# Altium project CM4_TAB.PrjPcb
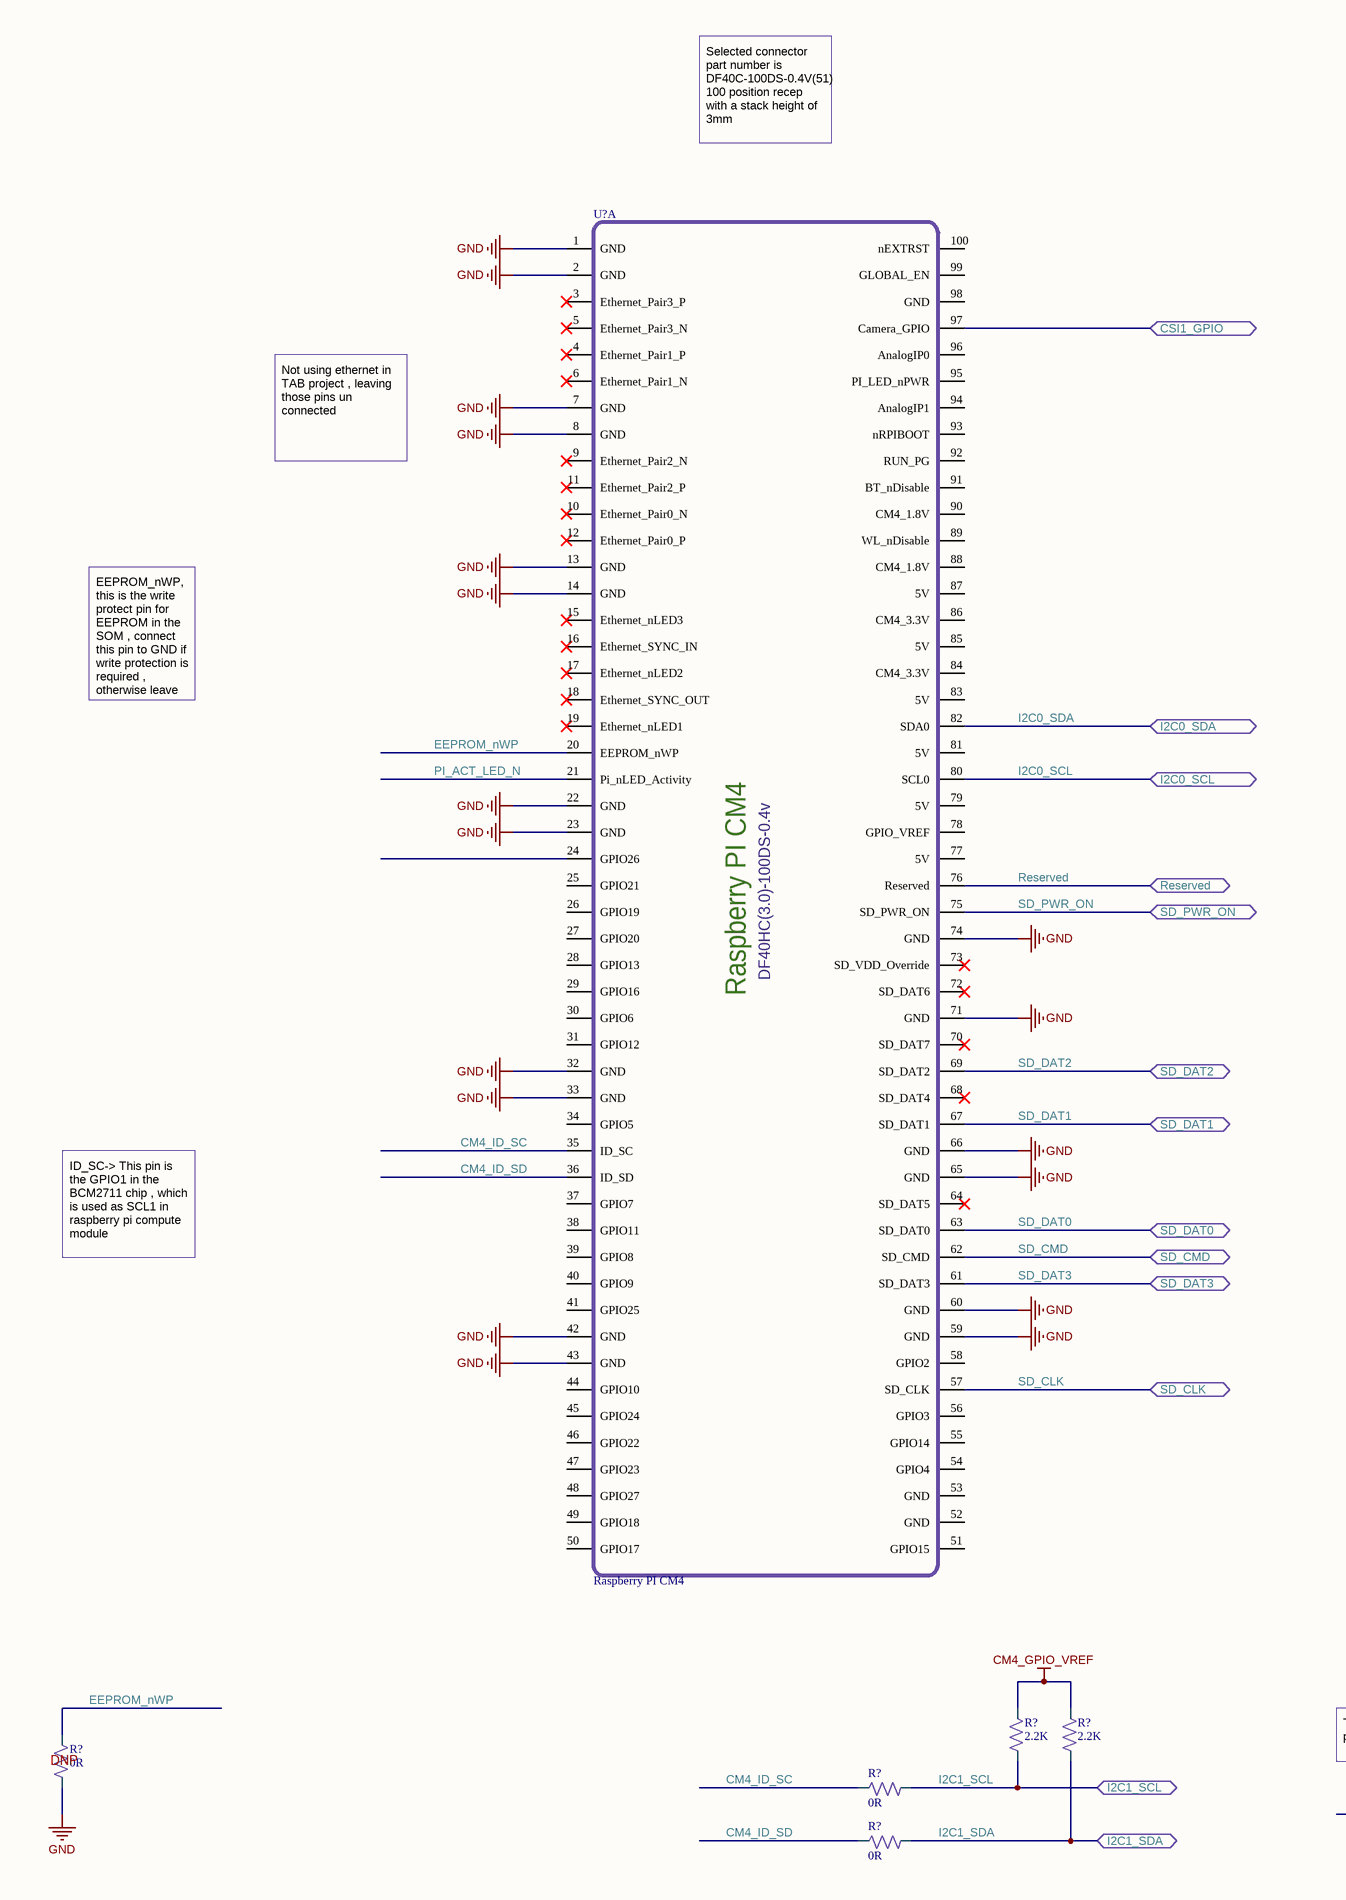
[diagram p0: Compute_module4_connector.SchDoc, left]
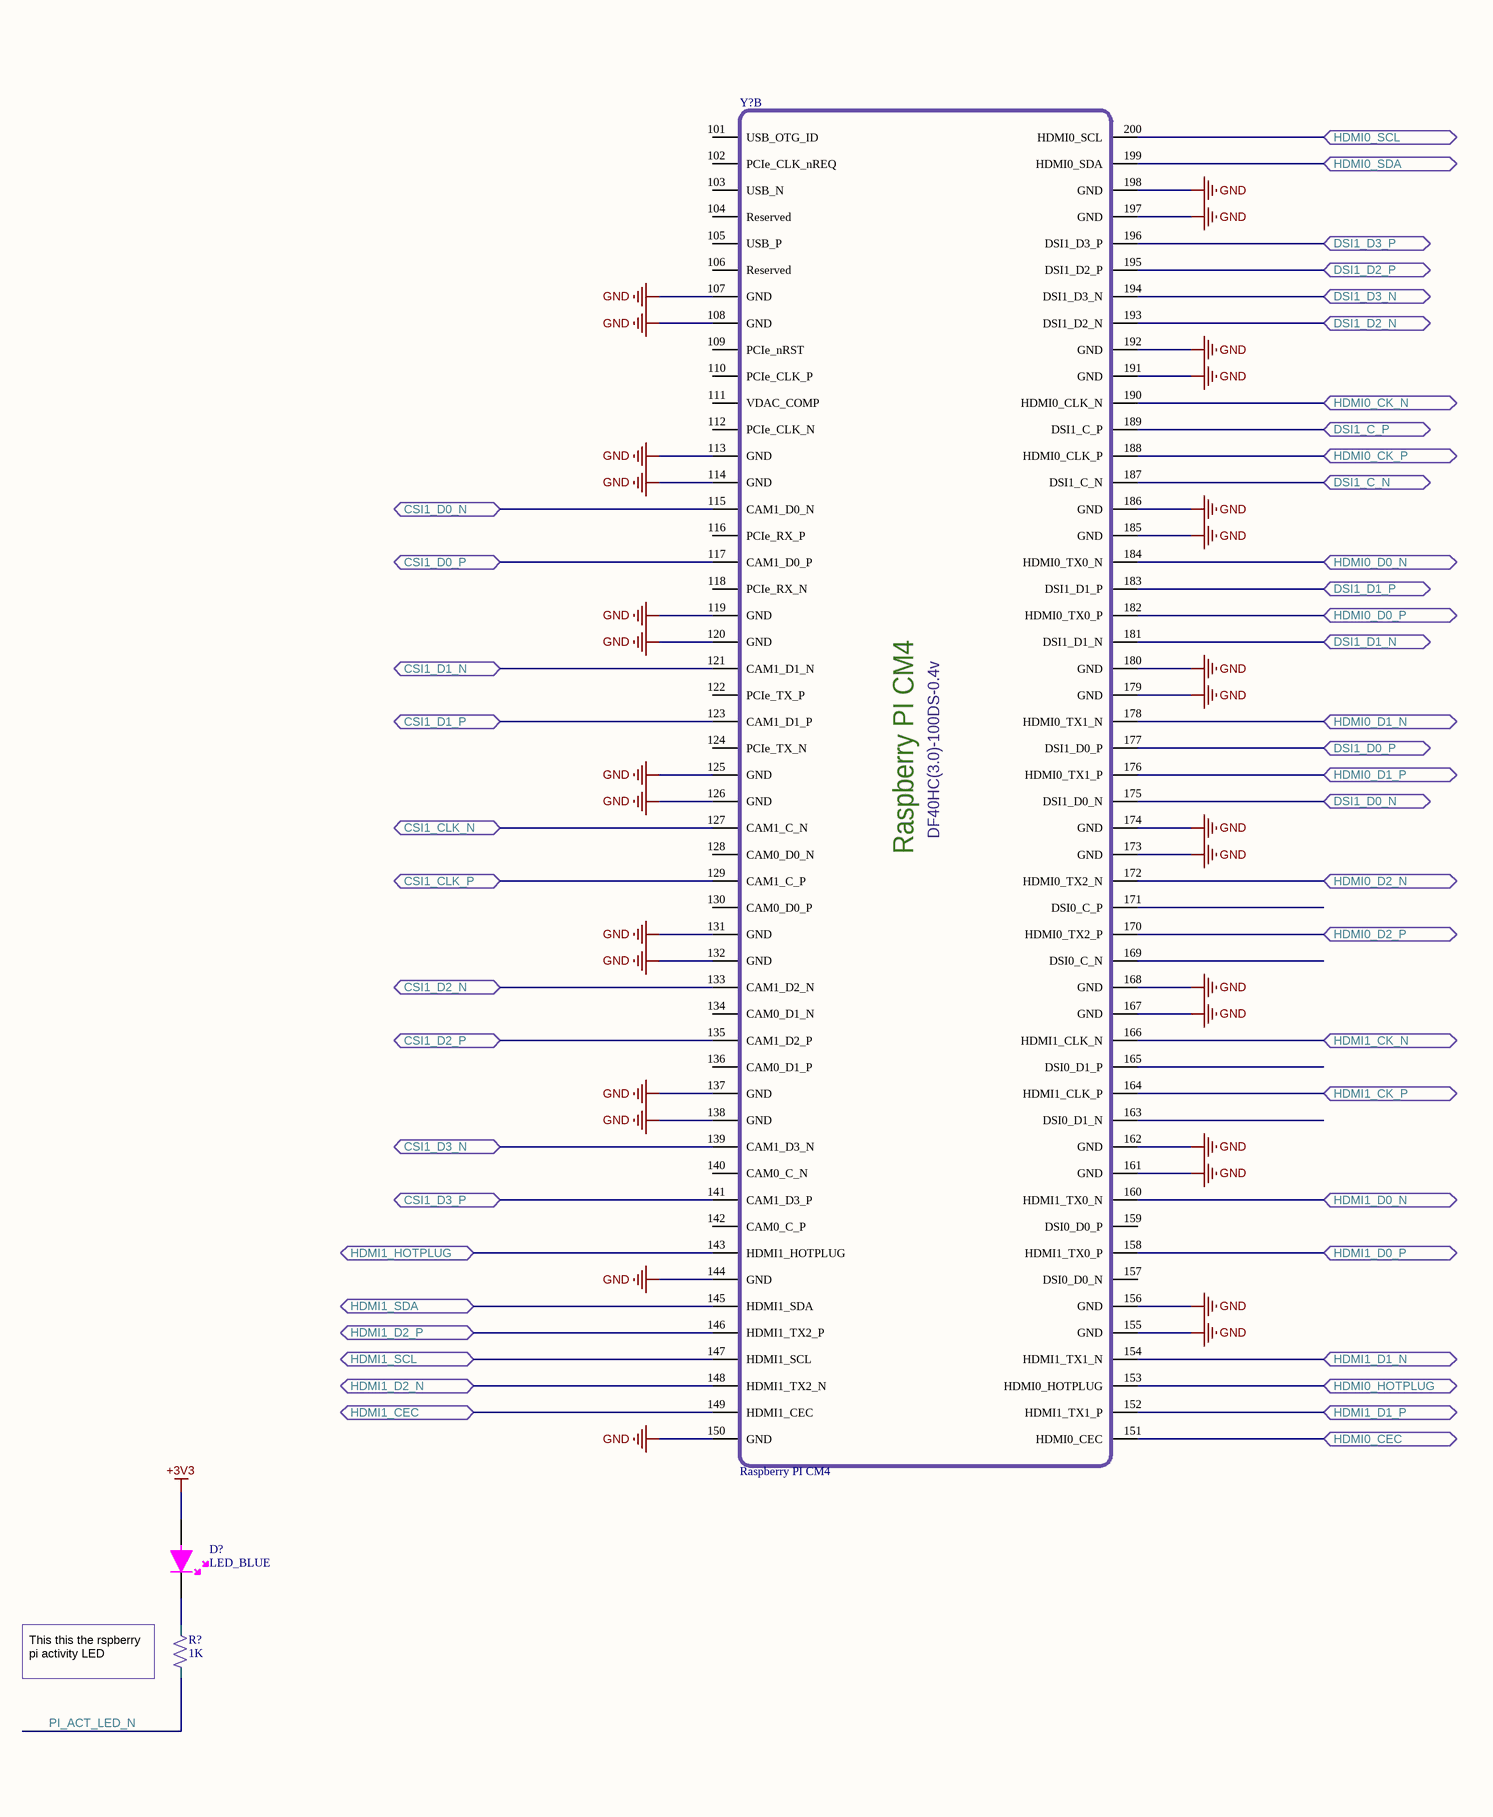
[diagram p1: Compute_module4_connector.SchDoc, right]
5 sheets, 21 parts. Net scope: flat (ports and power ports of the same name join across sheets).
Sheets:
  Compute_module4_connector.SchDoc
  dummy sheet.SchDoc
  SD_Card_Schematic.SchDoc
  HDMI_Schematic.SchDoc
  DSI_and_CSI_Connector.SchDoc

## Sheet Compute_module4_connector.SchDoc
size A2; SheetNumber: 1; SheetTotal: 5

### Parts
(Parts that share a designator on the sheet are numbered #1, #2 ... from top to bottom, then left to right.)
D?  LED_BLUE  [0603_LED]
R?#1  2.2K  [RESISTOR_0402]
R?#2  2.2K  [RESISTOR_0402]
R?#3  1K  [RESISTOR_0402]
R?#4  0R  [RESISTOR_0402]
R?#5  0R  [RESISTOR_0402]
R?#6  0R  [RESISTOR_0402]
U?#1  Raspberry PI CM4  [CM4-DF40HC(3.0)-100DS-0.4v_3mm_1.5mm]  (part A of 2)
Y?  Raspberry PI CM4  [CM4-DF40HC(3.0)-100DS-0.4v_3mm_1.5mm]  (part B of 2)

### Ports
CSI1_CLK_N (bidir), CSI1_CLK_P (bidir), CSI1_D0_N (bidir), CSI1_D0_P (bidir), CSI1_D1_N (bidir), CSI1_D1_P (bidir), CSI1_D2_N (bidir), CSI1_D2_P (bidir), CSI1_D3_N (bidir), CSI1_D3_P (bidir), CSI1_GPIO (bidir), DSI1_C_N (bidir), DSI1_C_P (bidir), DSI1_D0_N (bidir), DSI1_D0_P (bidir), DSI1_D1_N (bidir), DSI1_D1_P (bidir), DSI1_D2_N (bidir), DSI1_D2_P (bidir), DSI1_D3_N (bidir), DSI1_D3_P (bidir), HDMI0_CEC (bidir), HDMI0_CK_N (bidir), HDMI0_CK_P (bidir), HDMI0_D0_N (bidir), HDMI0_D0_P (bidir), HDMI0_D1_N (bidir), HDMI0_D1_P (bidir), HDMI0_D2_N (bidir), HDMI0_D2_P (bidir), HDMI0_HOTPLUG (bidir), HDMI0_SCL (bidir), HDMI0_SDA (bidir), HDMI1_CEC (bidir), HDMI1_CK_N (bidir), HDMI1_CK_P (bidir), HDMI1_D0_N (bidir), HDMI1_D0_P (bidir), HDMI1_D1_N (bidir), HDMI1_D1_P (bidir), HDMI1_D2_N (bidir), HDMI1_D2_P (bidir), HDMI1_HOTPLUG (bidir), HDMI1_SCL (bidir), HDMI1_SDA (bidir), I2C0_SCL (bidir), I2C0_SDA (bidir), I2C1_SCL (bidir), I2C1_SDA (bidir), Reserved (bidir), SD_CLK (bidir), SD_CMD (bidir), SD_DAT0 (bidir), SD_DAT1 (bidir), SD_DAT2 (bidir), SD_DAT3 (bidir), SD_PWR_ON (bidir)

### Nets
+3V3: D?.1
CM4_GPIO_VREF: R?#1.2 R?#2.2
GND: R?#4.1 U?#1.1(GND) U?#1.2(GND) U?#1.7(GND) U?#1.8(GND) U?#1.13(GND) U?#1.14(GND) U?#1.22(GND) U?#1.23(GND) U?#1.32(GND) U?#1.33(GND) U?#1.42(GND) U?#1.43(GND) U?#1.59(GND) U?#1.60(GND) U?#1.65(GND) U?#1.66(GND) U?#1.71(GND) U?#1.74(GND) Y?.107(GND) Y?.108(GND) Y?.113(GND) Y?.114(GND) Y?.119(GND) Y?.120(GND) Y?.125(GND) Y?.126(GND) Y?.131(GND) Y?.132(GND) Y?.137(GND) Y?.138(GND) Y?.144(GND) Y?.150(GND) Y?.155(GND) Y?.156(GND) Y?.161(GND) Y?.162(GND) Y?.167(GND) Y?.168(GND) Y?.173(GND) Y?.174(GND) Y?.179(GND) Y?.180(GND) Y?.185(GND) Y?.186(GND) Y?.191(GND) Y?.192(GND) Y?.197(GND) Y?.198(GND)
CM4_ID_SC: R?#5.2 U?#1.35(ID_SC)
CM4_ID_SD: R?#6.2 U?#1.36(ID_SD)
CSI1_CLK_N: Y?.127(CAM1_C_N) ; port CSI1_CLK_N
CSI1_CLK_P: Y?.129(CAM1_C_P) ; port CSI1_CLK_P
CSI1_D0_N: Y?.115(CAM1_D0_N) ; port CSI1_D0_N
CSI1_D0_P: Y?.117(CAM1_D0_P) ; port CSI1_D0_P
CSI1_D1_N: Y?.121(CAM1_D1_N) ; port CSI1_D1_N
CSI1_D1_P: Y?.123(CAM1_D1_P) ; port CSI1_D1_P
CSI1_D2_N: Y?.133(CAM1_D2_N) ; port CSI1_D2_N
CSI1_D2_P: Y?.135(CAM1_D2_P) ; port CSI1_D2_P
CSI1_D3_N: Y?.139(CAM1_D3_N) ; port CSI1_D3_N
CSI1_D3_P: Y?.141(CAM1_D3_P) ; port CSI1_D3_P
CSI1_GPIO: U?#1.97(Camera_GPIO) ; port CSI1_GPIO
DSI1_C_N: Y?.187(DSI1_C_N) ; port DSI1_C_N
DSI1_C_P: Y?.189(DSI1_C_P) ; port DSI1_C_P
DSI1_D0_N: Y?.175(DSI1_D0_N) ; port DSI1_D0_N
DSI1_D0_P: Y?.177(DSI1_D0_P) ; port DSI1_D0_P
DSI1_D1_N: Y?.181(DSI1_D1_N) ; port DSI1_D1_N
DSI1_D1_P: Y?.183(DSI1_D1_P) ; port DSI1_D1_P
DSI1_D2_N: Y?.193(DSI1_D2_N) ; port DSI1_D2_N
DSI1_D2_P: Y?.195(DSI1_D2_P) ; port DSI1_D2_P
DSI1_D3_N: Y?.194(DSI1_D3_N) ; port DSI1_D3_N
DSI1_D3_P: Y?.196(DSI1_D3_P) ; port DSI1_D3_P
EEPROM_nWP: R?#4.2 U?#1.20(EEPROM_nWP)
HDMI0_CEC: Y?.151(HDMI0_CEC) ; port HDMI0_CEC
HDMI0_CK_N: Y?.190(HDMI0_CLK_N) ; port HDMI0_CK_N
HDMI0_CK_P: Y?.188(HDMI0_CLK_P) ; port HDMI0_CK_P
HDMI0_D0_N: Y?.184(HDMI0_TX0_N) ; port HDMI0_D0_N
HDMI0_D0_P: Y?.182(HDMI0_TX0_P) ; port HDMI0_D0_P
HDMI0_D1_N: Y?.178(HDMI0_TX1_N) ; port HDMI0_D1_N
HDMI0_D1_P: Y?.176(HDMI0_TX1_P) ; port HDMI0_D1_P
HDMI0_D2_N: Y?.172(HDMI0_TX2_N) ; port HDMI0_D2_N
HDMI0_D2_P: Y?.170(HDMI0_TX2_P) ; port HDMI0_D2_P
HDMI0_HOTPLUG: Y?.153(HDMI0_HOTPLUG) ; port HDMI0_HOTPLUG
HDMI0_SCL: Y?.200(HDMI0_SCL) ; port HDMI0_SCL
HDMI0_SDA: Y?.199(HDMI0_SDA) ; port HDMI0_SDA
HDMI1_CEC: Y?.149(HDMI1_CEC) ; port HDMI1_CEC
HDMI1_CK_N: Y?.166(HDMI1_CLK_N) ; port HDMI1_CK_N
HDMI1_CK_P: Y?.164(HDMI1_CLK_P) ; port HDMI1_CK_P
HDMI1_D0_N: Y?.160(HDMI1_TX0_N) ; port HDMI1_D0_N
HDMI1_D0_P: Y?.158(HDMI1_TX0_P) ; port HDMI1_D0_P
HDMI1_D1_N: Y?.154(HDMI1_TX1_N) ; port HDMI1_D1_N
HDMI1_D1_P: Y?.152(HDMI1_TX1_P) ; port HDMI1_D1_P
HDMI1_D2_N: Y?.148(HDMI1_TX2_N) ; port HDMI1_D2_N
HDMI1_D2_P: Y?.146(HDMI1_TX2_P) ; port HDMI1_D2_P
HDMI1_HOTPLUG: Y?.143(HDMI1_HOTPLUG) ; port HDMI1_HOTPLUG
HDMI1_SCL: Y?.147(HDMI1_SCL) ; port HDMI1_SCL
HDMI1_SDA: Y?.145(HDMI1_SDA) ; port HDMI1_SDA
I2C0_SCL: U?#1.80(SCL0) ; port I2C0_SCL
I2C0_SDA: U?#1.82(SDA0) ; port I2C0_SDA
I2C1_SCL: R?#1.1 R?#5.1 ; port I2C1_SCL
I2C1_SDA: R?#2.1 R?#6.1 ; port I2C1_SDA
PI_ACT_LED_N: R?#3.1 U?#1.21(Pi_nLED_Activity)
Reserved: U?#1.76(Reserved) ; port Reserved
SD_CLK: U?#1.57(SD_CLK) ; port SD_CLK
SD_CMD: U?#1.62(SD_CMD) ; port SD_CMD
SD_DAT0: U?#1.63(SD_DAT0) ; port SD_DAT0
SD_DAT1: U?#1.67(SD_DAT1) ; port SD_DAT1
SD_DAT2: U?#1.69(SD_DAT2) ; port SD_DAT2
SD_DAT3: U?#1.61(SD_DAT3) ; port SD_DAT3
SD_PWR_ON: U?#1.75(SD_PWR_ON) ; port SD_PWR_ON
NetD?_2: D?.2 R?#3.2

Not connected (* = marked no-connect by the designer): U?#1 3(Ethernet_Pair3_P)* 4(Ethernet_Pair1_P)* 5(Ethernet_Pair3_N)* 6(Ethernet_Pair1_N)* 9(Ethernet_Pair2_N)* 10(Ethernet_Pair0_N)* 11(Ethernet_Pair2_P)* 12(Ethernet_Pair0_P)* 15(Ethernet_nLED3)* 16(Ethernet_SYNC_IN)* 17(Ethernet_nLED2)* 18(Ethernet_SYNC_OUT)* 19(Ethernet_nLED1)* 24(GPIO26) 25(GPIO21) 26(GPIO19) 27(GPIO20) 28(GPIO13) 29(GPIO16) 30(GPIO6) 31(GPIO12) 34(GPIO5) 37(GPIO7) 38(GPIO11) 39(GPIO8) 40(GPIO9) 41(GPIO25) 44(GPIO10) 45(GPIO24) 46(GPIO22) 47(GPIO23) 48(GPIO27) 49(GPIO18) 50(GPIO17) 51(GPIO15) 52(GND) 53(GND) 54(GPIO4) 55(GPIO14) 56(GPIO3) 58(GPIO2) 64(SD_DAT5)* 68(SD_DAT4)* 70(SD_DAT7)* 72(SD_DAT6)* 73(SD_VDD_Override)* 77(5V) 78(GPIO_VREF) 79(5V) 81(5V) 83(5V) 84(CM4_3.3V) 85(5V) 86(CM4_3.3V) 87(5V) 88(CM4_1.8V) 89(WL_nDisable) 90(CM4_1.8V) 91(BT_nDisable) 92(RUN_PG) 93(nRPIBOOT) 94(AnalogIP1) 95(PI_LED_nPWR) 96(AnalogIP0) 98(GND) 99(GLOBAL_EN) 100(nEXTRST); Y? 101(USB_OTG_ID) 102(PCIe_CLK_nREQ) 103(USB_N) 104(Reserved) 105(USB_P) 106(Reserved) 109(PCIe_nRST) 110(PCIe_CLK_P) 111(VDAC_COMP) 112(PCIe_CLK_N) 116(PCIe_RX_P) 118(PCIe_RX_N) 122(PCIe_TX_P) 124(PCIe_TX_N) 128(CAM0_D0_N) 130(CAM0_D0_P) 134(CAM0_D1_N) 136(CAM0_D1_P) 140(CAM0_C_N) 142(CAM0_C_P) 157(DSI0_D0_N) 159(DSI0_D0_P) 163(DSI0_D1_N) 165(DSI0_D1_P) 169(DSI0_C_N) 171(DSI0_C_P)

### Notes on the sheet
- Selected connector part number is DF40C-100DS-0.4V(51)
  100 position recep with a stack height of 3mm
- Not using ethernet in TAB project , leaving those pins un connected
- EEPROM_nWP, this is the write protect pin for EEPROM in the SOM , connect this pin to GND if write protection is required , otherwise leave this pin unconnected , an  internal pull up is provided for this via 100K resistor to 3v3
- ID_SC-> This pin is the GPIO1 in the BCM2711 chip , which is used as SCL1 in raspberry pi compute module
  ID_SC -> This pin is the GPIO0 pin in the BCM2711 chip , which is used as SDA1 in raspberry pi compute module
- (near R?#4) DNP
- (near R?#3) This this the rspberry pi activity LED
- (in symbol cm4, part A) DF40HC(3.0)-100DS-0.4v
- (in symbol cm4, part B) DF40HC(3.0)-100DS-0.4v

### Library data of the parts
D? = NCD0603B1: blue 0603 Light Emitting Diodes (LED) ROHS; Manufacturer: Foshan; ManufacturerPartNumber: NCD0603B1; SupplierPartNumber: C84266; Supplier: LCSC; MinTemp: *; MaxTemp: *; Price: 0.0171; ComponentLink1Description: SupplierURL; ComponentLink1URL: https://www.lcsc.com/product-detail/Light-Emitting-Diodes-LED_Foshan-NationStar-Optoelectronics-NCD0603B1_C84266.html
R?#1 R?#2 = ERJPA2F2201X: 200mW Thick Film Resistors ±1% 2.2kΩ 0402 Chip Resistor - Surface Mount ROHS; Manufacturer: Panasonic; MinTemp: -55℃; MaxTemp: +155℃; ManufacturerPartNumber: ERJPA2F2201X; SupplierPartNumber: C427242; Supplier: LCSC; Price: 0.0307; ComponentLink1Description: SupplierURL; ComponentLink1URL: https://www.lcsc.com/product-detail/Chip-Resistor-Surface-Mount_PANASONIC-ERJPA2F2201X_C427242.html
R?#3 = ERJ2RKF1001X: ±1% 100mW ±100ppm/℃ -55℃~+155℃ 1kΩ 0402 Chip Resistor - Surface Mount ROHS; Manufacturer: PANASONIC; MinTemp: -55℃; MaxTemp: +155℃; ManufacturerPartNumber: ERJ2RKF1001X; SupplierPartNumber: C242161; Supplier: LCSC; ComponentLink1Description: SupplierURL; ComponentLink1URL: https://lcsc.com/product-detail/Chip-Resistor-Surface-Mount_PANASONIC-ERJ2RKF1001X_C242161.html
R?#4 = HCJ0402ZT0R00_1: 125mW Thick Film Resistors -55℃~+155℃ 0Ω 0402 Chip Resistor - Surface Mount ROHS; Manufacturer: SEI(Stackpole Elec); MinTemp: -55℃; MaxTemp: +155℃; ManufacturerPartNumber: HCJ0402ZT0R00; SupplierPartNumber: C346504; Supplier: LCSC; Price: 0.1734; ComponentLink1Description: SupplierURL; ComponentLink1URL: https://lcsc.com/product-detail/Chip-Resistor-Surface-Mount_SEI-Stackpole-Elec-HCJ0402ZT0R00_C346504.html
R?#5 R?#6 = HCJ0402ZT0R00: 0 Ohms Jumper 0.125W, 1/8W Chip Resistor 0402 (1005 Metric) Automotive AEC-Q200 Metal Foil; Manufacturer: Stackpole Electronics Inc; MinTemp: -55°C; MaxTemp: 155°C; ManufacturerPartNumber: HCJ0402ZT0R00; SupplierPartNumber: HCJ0402ZT0R00CT-ND; Supplier: Digikey; PartStatus: Active; Price: 38.65(INR); ComponentLink1Description: SupplierURL; ComponentLink1URL: https://www.digikey.in/en/products/detail/stackpole-electronics-inc/HCJ0402ZT0R00/4357659
U?#1 Y? = cm4: Raspberry pi compute module 4

## Sheet dummy sheet.SchDoc
size A0; SheetNumber: 2; SheetTotal: 5

## Sheet SD_Card_Schematic.SchDoc
size A3; SheetNumber: 3; SheetTotal: 3
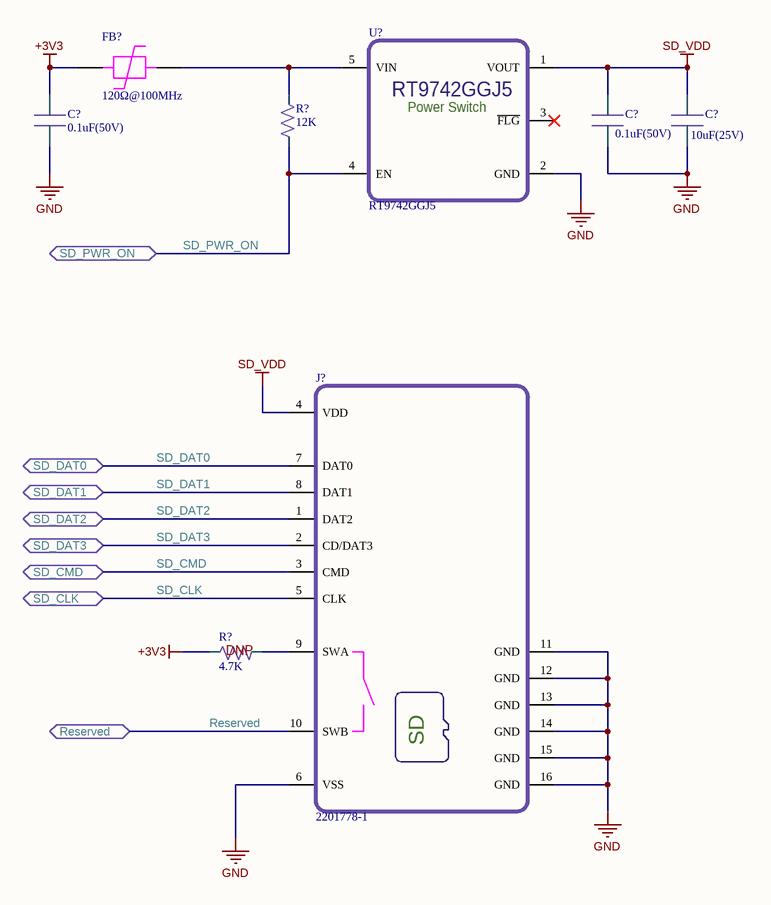
[diagram p2: SD_Card_Schematic.SchDoc]

### Parts
(Parts that share a designator on the sheet are numbered #1, #2 ... from top to bottom, then left to right.)
C?#1  0.1uF(50V)  [Capacitor_0603]
C?#2  0.1uF(50V)  [Capacitor_0603]
C?#3  10uF(25V)  [Capacitor_0603]
FB?  120Ω@100MHz  [FB0402]
J?#1  2201778-1
R?#7  12K  [RESISTOR_0402]
R?#8  4.7K  [RESISTOR_0402]
U?#2  RT9742GGJ5  [SOT23-5]

### Ports
Reserved (bidir), SD_CLK (bidir), SD_CMD (bidir), SD_DAT0 (bidir), SD_DAT1 (bidir), SD_DAT2 (bidir), SD_DAT3 (bidir), SD_PWR_ON (bidir)

### Nets
+3V3: C?#1.2 FB?.1 R?#8.2
GND: C?#1.1 C?#2.1 C?#3.1 J?#1.6(VSS) J?#1.11(GND) J?#1.12(GND) J?#1.13(GND) J?#1.14(GND) J?#1.15(GND) J?#1.16(GND) U?#2.2(GND)
SD_VDD: C?#2.2 C?#3.2 J?#1.4(VDD) U?#2.1(VOUT)
Reserved: J?#1.10(SWB) ; port Reserved
SD_CLK: J?#1.5(CLK) ; port SD_CLK
SD_CMD: J?#1.3(CMD) ; port SD_CMD
SD_DAT0: J?#1.7(DAT0) ; port SD_DAT0
SD_DAT1: J?#1.8(DAT1) ; port SD_DAT1
SD_DAT2: J?#1.1(DAT2) ; port SD_DAT2
SD_DAT3: J?#1.2(CD/DAT3) ; port SD_DAT3
SD_PWR_ON: R?#7.1 U?#2.4(EN) ; port SD_PWR_ON
NetFB?_2: FB?.2 R?#7.2 U?#2.5(VIN)
NetJ?#1_9: J?#1.9(SWA) R?#8.1

Not connected (* = marked no-connect by the designer): U?#2 3(~{FLG})*

### Notes on the sheet
- (near R?#8) DNP
- (in symbol 2201778-1) SD
- (in symbol RT9742GGJ5) Power Switch

### Library data of the parts
C?#1 C?#2 = GCJ188R71H104KA12D: 50V 100nF X7R ±10% 0603 Multilayer Ceramic Capacitors MLCC - SMD/SMT ROHS; Manufacturer: Murata; MinTemp: -55°C; MaxTemp: 125 °C; ManufacturerPartNumber: GCJ188R71H104KA12D; SupplierPartNumber: C161115; Supplier: LCSC; Price: 0.83; ComponentLink1Description: SupplierURL; ComponentLink1URL: https://www.lcsc.com/product-detail/Multilayer-Ceramic-Capacitors-MLCC-SMD-SMT_Murata-Electronics-GCJ188R71H104KA12D_C161115.html
C?#3 = C0603X5R106K250NT: 25V 10uF ±10% 0603 Multilayer Ceramic Capacitors MLCC - SMD/SMT ROHS; Manufacturer: sanyear; MinTemp: -55 C; MaxTemp: 125 C; ManufacturerPartNumber: C0603X5R106K250NT; SupplierPartNumber: C729457; Supplier: LCSC; Price: 0.0390; ComponentLink1Description: SupplierURL; ComponentLink1URL: https://www.lcsc.com/product-detail/Multilayer-Ceramic-Capacitors-MLCC-SMD-SMT_SANYEAR-C0603X5R106K250NT_C729457.html
FB? = BLM15KD121SN1D: 1.5A 1 70mΩ 120Ω@100MHz ±25% 0402 Ferrite Beads ROHS; Manufacturer: Murata Electronics; MinTemp: -55°C; MaxTemp: +125°C; ManufacturerPartNumber: BLM15KD121SN1D; SupplierPartNumber: C710343; Supplier: LCSC; Price: 0.0169; ComponentLink1Description: SupplierURL; ComponentLink1URL: https://lcsc.com/product-detail/Ferrite-Beads_Murata-Electronics-BLM15KD121SN1D_C710343.html
J?#1 = 2201778-1: - SD Card Connectors ROHS; Manufacturer: TE Connectivity; ManufacturerPartNumber: 2201778-1; SupplierPartNumber: C590836; Supplier: LCSC; MinTemp: *; MaxTemp: *; Price: 2.2941; ComponentLink1Description: SupplierURL; ComponentLink1URL: https://www.lcsc.com/product-detail/span-style-background-color-ff0-SD-span-span-style-background-color-ff0-Card-span-Connectors_TE-Connectivity-2201778-1_C590836.html
R?#7 = HPCR0402F12K0K9: ±1% 100mW Thick Film Resistors 50V ±100ppm/℃ 12kΩ -55℃~+125℃ 0402 Chip Resistor - Surface Mount ROHS; Manufacturer: Resistor.Today; MinTemp: -55℃; MaxTemp: +125℃; ManufacturerPartNumber: HPCR0402F12K0K9; SupplierPartNumber: C363271; Supplier: LCSC; Price: 0.0074; ComponentLink1Description: SupplierURL; ComponentLink1URL: https://lcsc.com/product-detail/Chip-Resistor-Surface-Mount_Resistor-Today-HPCR0402F12K0K9_C363271.html
R?#8 = ERJPA2F4701X: ±1% 200mW ±100ppm/℃ -55℃~+155℃ 4.7kΩ 0402 Chip Resistor - Surface Mount ROHS; Manufacturer: PANASONIC; MinTemp: -55℃; MaxTemp: +155℃; ManufacturerPartNumber: ERJPA2F4701X; SupplierPartNumber: C427244; Supplier: LCSC; Price: 0.0477; ComponentLink1Description: SupplierURL; ComponentLink1URL: https://lcsc.com/product-detail/Chip-Resistor-Surface-Mount_PANASONIC-ERJPA2F4701X_C427244.html
U?#2 = RT9742GGJ5: TSOT-23-5 Power Distribution Switches ROHS; Manufacturer: Richtek; ManufacturerPartNumber: RT9742GGJ5; SupplierPartNumber: C250547; Supplier: LCSC; MinTemp: *; MaxTemp: *; Price: 1.3062; ComponentLink1Description: SupplierURL; ComponentLink1URL: https://www.lcsc.com/product-detail/Power-Distribution-Switches_Richtek-Tech-RT9742GGJ5_C250547.html

## Sheet HDMI_Schematic.SchDoc
size A2; SheetNumber: 4; SheetTotal: 5
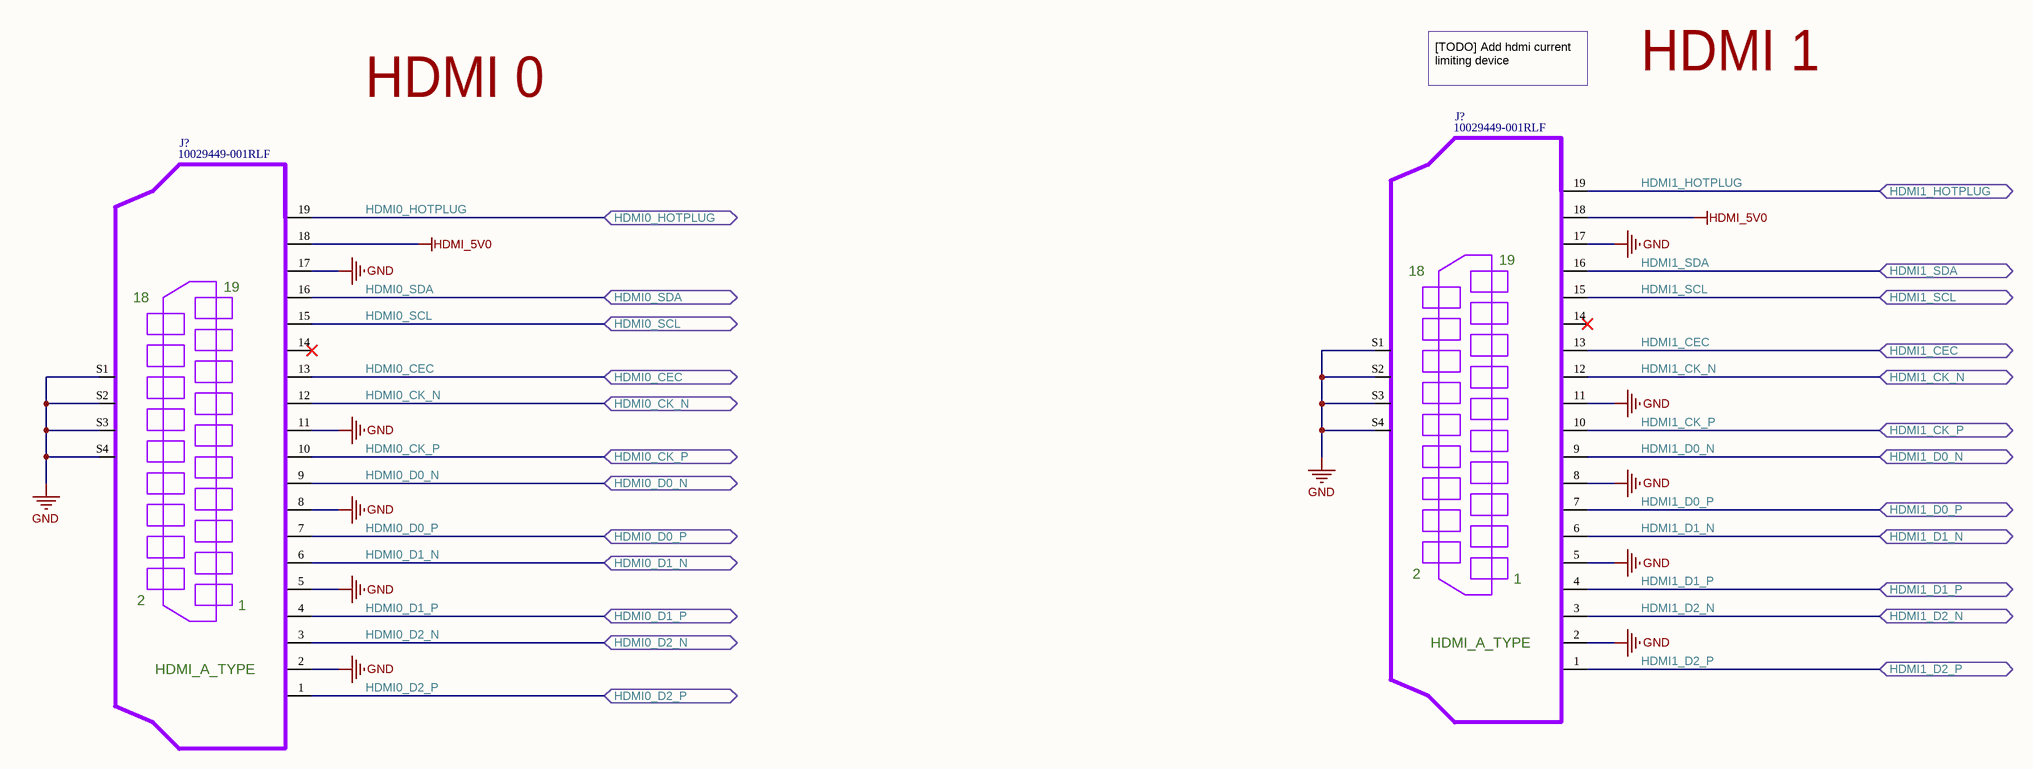
[diagram p3: HDMI_Schematic.SchDoc]

### Parts
(Parts that share a designator on the sheet are numbered #1, #2 ... from top to bottom, then left to right.)
J?#2  10029449-001RLF  [AMPHENOL_10029449-001RLF_HDMI]
J?#3  10029449-001RLF  [AMPHENOL_10029449-001RLF_HDMI]

### Ports
HDMI0_CEC (bidir), HDMI0_CK_N (bidir), HDMI0_CK_P (bidir), HDMI0_D0_N (bidir), HDMI0_D0_P (bidir), HDMI0_D1_N (bidir), HDMI0_D1_P (bidir), HDMI0_D2_N (bidir), HDMI0_D2_P (bidir), HDMI0_HOTPLUG (bidir), HDMI0_SCL (bidir), HDMI0_SDA (bidir), HDMI1_CEC (bidir), HDMI1_CK_N (bidir), HDMI1_CK_P (bidir), HDMI1_D0_N (bidir), HDMI1_D0_P (bidir), HDMI1_D1_N (bidir), HDMI1_D1_P (bidir), HDMI1_D2_N (bidir), HDMI1_D2_P (bidir), HDMI1_HOTPLUG (bidir), HDMI1_SCL (bidir), HDMI1_SDA (bidir)

### Nets
GND: J?#2.2 J?#2.5 J?#2.8 J?#2.11 J?#2.17 J?#2.S1 J?#2.S2 J?#2.S3 J?#2.S4 J?#3.2 J?#3.5 J?#3.8 J?#3.11 J?#3.17 J?#3.S1 J?#3.S2 J?#3.S3 J?#3.S4
HDMI_5V0: J?#2.18 J?#3.18
HDMI0_CEC: J?#3.13 ; port HDMI0_CEC
HDMI0_CK_N: J?#3.12 ; port HDMI0_CK_N
HDMI0_CK_P: J?#3.10 ; port HDMI0_CK_P
HDMI0_D0_N: J?#3.9 ; port HDMI0_D0_N
HDMI0_D0_P: J?#3.7 ; port HDMI0_D0_P
HDMI0_D1_N: J?#3.6 ; port HDMI0_D1_N
HDMI0_D1_P: J?#3.4 ; port HDMI0_D1_P
HDMI0_D2_N: J?#3.3 ; port HDMI0_D2_N
HDMI0_D2_P: J?#3.1 ; port HDMI0_D2_P
HDMI0_HOTPLUG: J?#3.19 ; port HDMI0_HOTPLUG
HDMI0_SCL: J?#3.15 ; port HDMI0_SCL
HDMI0_SDA: J?#3.16 ; port HDMI0_SDA
HDMI1_CEC: J?#2.13 ; port HDMI1_CEC
HDMI1_CK_N: J?#2.12 ; port HDMI1_CK_N
HDMI1_CK_P: J?#2.10 ; port HDMI1_CK_P
HDMI1_D0_N: J?#2.9 ; port HDMI1_D0_N
HDMI1_D0_P: J?#2.7 ; port HDMI1_D0_P
HDMI1_D1_N: J?#2.6 ; port HDMI1_D1_N
HDMI1_D1_P: J?#2.4 ; port HDMI1_D1_P
HDMI1_D2_N: J?#2.3 ; port HDMI1_D2_N
HDMI1_D2_P: J?#2.1 ; port HDMI1_D2_P
HDMI1_HOTPLUG: J?#2.19 ; port HDMI1_HOTPLUG
HDMI1_SCL: J?#2.15 ; port HDMI1_SCL
HDMI1_SDA: J?#2.16 ; port HDMI1_SDA

Not connected (* = marked no-connect by the designer): J?#2 14*; J?#3 14*

### Notes on the sheet
- HDMI 0
- [TODO] Add hdmi current limiting device
- HDMI 1
- (in symbol 10029449-001RLF) HDMI_A_TYPE

### Library data of the parts
J?#2 J?#3 = 10029449-001RLF: HDMI, Displayport & DVI Connectors TYPE A RECEPTACLE; Manufacturer: Amphenol FCI; MinTemp: - 55 C; MaxTemp: + 85 C; ManufacturerPartNumber: 10029449-001RLF; SupplierPartNumber: 649-10029449-001RLF; Supplier: Mouser; PartStatus: Active; Price: 176.25(INR); ComponentLink1Description: SupplierURL; ComponentLink1URL: https://www.mouser.in/ProductDetail/Amphenol-FCI/10029449-001RLF?qs=D%252By4jQJzx8L60NhBOOKSqQ%3D%3D

## Sheet DSI_and_CSI_Connector.SchDoc
size A3; SheetNumber: 5; SheetTotal: 5
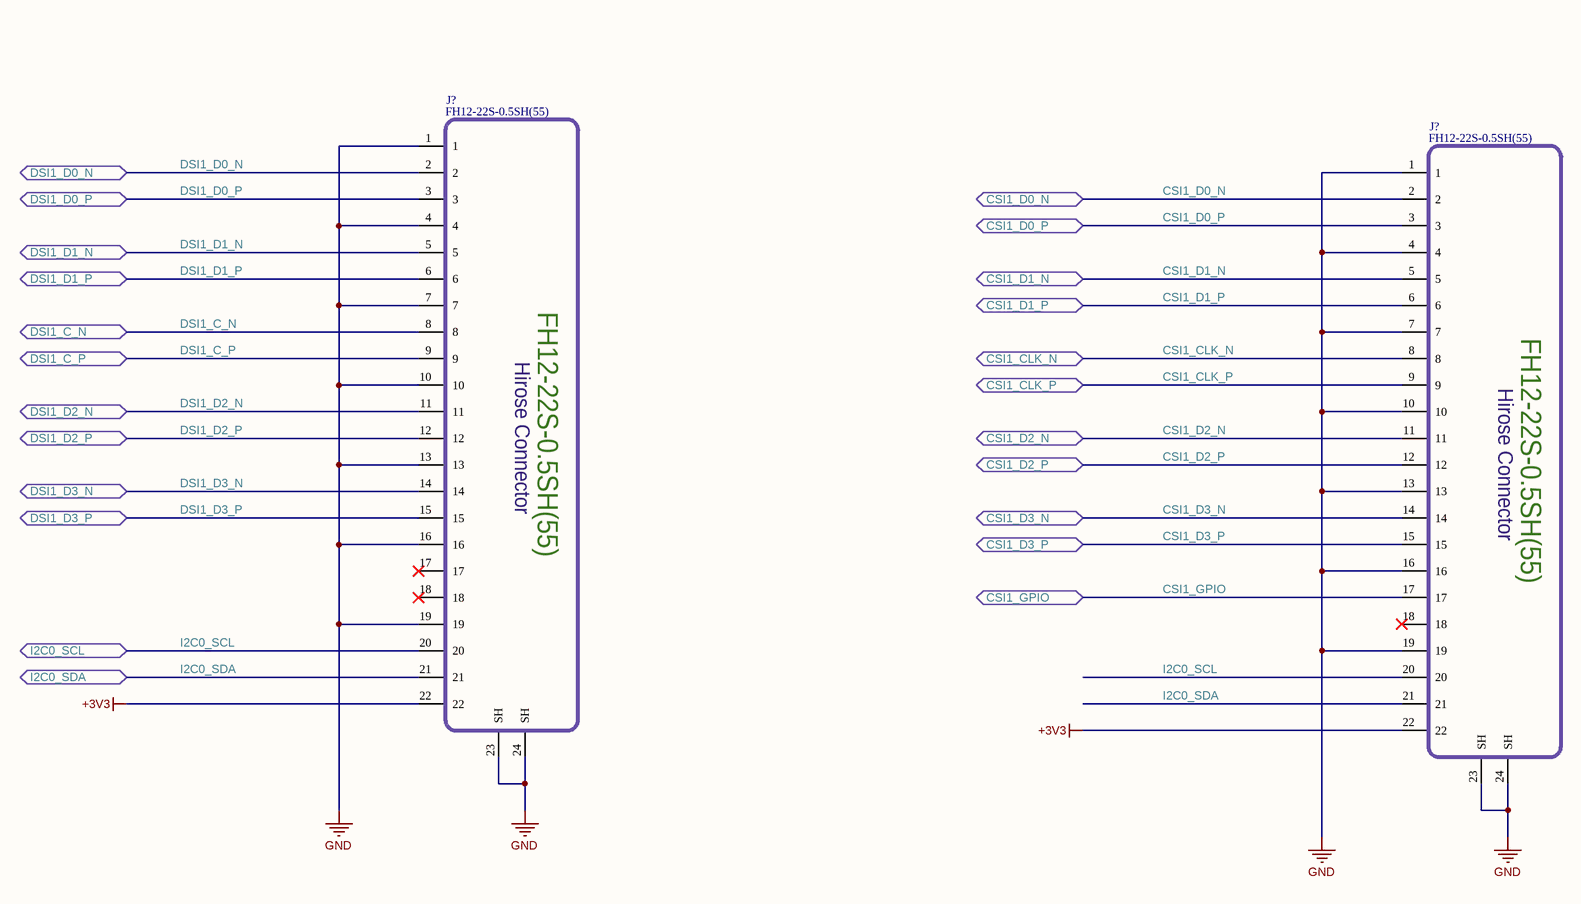
[diagram p4: DSI_and_CSI_Connector.SchDoc]

### Parts
(Parts that share a designator on the sheet are numbered #1, #2 ... from top to bottom, then left to right.)
J?#4  FH12-22S-0.5SH(55)
J?#5  FH12-22S-0.5SH(55)

### Ports
CSI1_CLK_N (bidir), CSI1_CLK_P (bidir), CSI1_D0_N (bidir), CSI1_D0_P (bidir), CSI1_D1_N (bidir), CSI1_D1_P (bidir), CSI1_D2_N (bidir), CSI1_D2_P (bidir), CSI1_D3_N (bidir), CSI1_D3_P (bidir), CSI1_GPIO (bidir), DSI1_C_N (bidir), DSI1_C_P (bidir), DSI1_D0_N (bidir), DSI1_D0_P (bidir), DSI1_D1_N (bidir), DSI1_D1_P (bidir), DSI1_D2_N (bidir), DSI1_D2_P (bidir), DSI1_D3_N (bidir), DSI1_D3_P (bidir), I2C0_SCL (bidir), I2C0_SDA (bidir)

### Nets
+3V3: J?#4.22 J?#5.22
GND: J?#4.1 J?#4.4 J?#4.7 J?#4.10 J?#4.13 J?#4.16 J?#4.19 J?#4.23(SH) J?#4.24(SH) J?#5.1 J?#5.4 J?#5.7 J?#5.10 J?#5.13 J?#5.16 J?#5.19 J?#5.23(SH) J?#5.24(SH)
CSI1_CLK_N: J?#5.8 ; port CSI1_CLK_N
CSI1_CLK_P: J?#5.9 ; port CSI1_CLK_P
CSI1_D0_N: J?#5.2 ; port CSI1_D0_N
CSI1_D0_P: J?#5.3 ; port CSI1_D0_P
CSI1_D1_N: J?#5.5 ; port CSI1_D1_N
CSI1_D1_P: J?#5.6 ; port CSI1_D1_P
CSI1_D2_N: J?#5.11 ; port CSI1_D2_N
CSI1_D2_P: J?#5.12 ; port CSI1_D2_P
CSI1_D3_N: J?#5.14 ; port CSI1_D3_N
CSI1_D3_P: J?#5.15 ; port CSI1_D3_P
CSI1_GPIO: J?#5.17 ; port CSI1_GPIO
DSI1_C_N: J?#4.8 ; port DSI1_C_N
DSI1_C_P: J?#4.9 ; port DSI1_C_P
DSI1_D0_N: J?#4.2 ; port DSI1_D0_N
DSI1_D0_P: J?#4.3 ; port DSI1_D0_P
DSI1_D1_N: J?#4.5 ; port DSI1_D1_N
DSI1_D1_P: J?#4.6 ; port DSI1_D1_P
DSI1_D2_N: J?#4.11 ; port DSI1_D2_N
DSI1_D2_P: J?#4.12 ; port DSI1_D2_P
DSI1_D3_N: J?#4.14 ; port DSI1_D3_N
DSI1_D3_P: J?#4.15 ; port DSI1_D3_P
I2C0_SCL: J?#4.20 J?#5.20 ; port I2C0_SCL
I2C0_SDA: J?#4.21 J?#5.21 ; port I2C0_SDA

Not connected (* = marked no-connect by the designer): J?#4 17* 18*; J?#5 18*

### Notes on the sheet
- (in symbol FH12-22S-0.5SH(55)) Hirose Connector

### Library data of the parts
J?#4 J?#5 = FH12-22S-0.5SH(55): 22 Position FFC, FPC Connector Contacts, Bottom 0.020" (0.50mm) Surface Mount, Right Angle; Manufacturer: Hirose Electric Co Ltd; MinTemp: -40°C; MaxTemp: 85°C; ManufacturerPartNumber: FH12-22S-0.5SH(55); SupplierPartNumber: HFJ122CT-ND; Supplier: Digikey; PartStatus: Active; Price: 2.00; ComponentLink1Description: SupplierURL; ComponentLink1URL: https://www.digikey.in/en/products/detail/hirose-electric-co-ltd/FH12-22S-0-5SH-55/1110321

## Nets that join several sheets
+3V3: Compute_module4_connector (D?.1), SD_Card_Schematic (C?#1.2 FB?.1 R?#8.2), DSI_and_CSI_Connector (J?#4.22 J?#5.22)
GND: Compute_module4_connector (49 pins), SD_Card_Schematic (11 pins), HDMI_Schematic (18 pins), DSI_and_CSI_Connector (18 pins)
CSI1_CLK_N: Compute_module4_connector (Y?.127), DSI_and_CSI_Connector (J?#5.8)
CSI1_CLK_P: Compute_module4_connector (Y?.129), DSI_and_CSI_Connector (J?#5.9)
CSI1_D0_N: Compute_module4_connector (Y?.115), DSI_and_CSI_Connector (J?#5.2)
CSI1_D0_P: Compute_module4_connector (Y?.117), DSI_and_CSI_Connector (J?#5.3)
CSI1_D1_N: Compute_module4_connector (Y?.121), DSI_and_CSI_Connector (J?#5.5)
CSI1_D1_P: Compute_module4_connector (Y?.123), DSI_and_CSI_Connector (J?#5.6)
CSI1_D2_N: Compute_module4_connector (Y?.133), DSI_and_CSI_Connector (J?#5.11)
CSI1_D2_P: Compute_module4_connector (Y?.135), DSI_and_CSI_Connector (J?#5.12)
CSI1_D3_N: Compute_module4_connector (Y?.139), DSI_and_CSI_Connector (J?#5.14)
CSI1_D3_P: Compute_module4_connector (Y?.141), DSI_and_CSI_Connector (J?#5.15)
CSI1_GPIO: Compute_module4_connector (U?#1.97), DSI_and_CSI_Connector (J?#5.17)
DSI1_C_N: Compute_module4_connector (Y?.187), DSI_and_CSI_Connector (J?#4.8)
DSI1_C_P: Compute_module4_connector (Y?.189), DSI_and_CSI_Connector (J?#4.9)
DSI1_D0_N: Compute_module4_connector (Y?.175), DSI_and_CSI_Connector (J?#4.2)
DSI1_D0_P: Compute_module4_connector (Y?.177), DSI_and_CSI_Connector (J?#4.3)
DSI1_D1_N: Compute_module4_connector (Y?.181), DSI_and_CSI_Connector (J?#4.5)
DSI1_D1_P: Compute_module4_connector (Y?.183), DSI_and_CSI_Connector (J?#4.6)
DSI1_D2_N: Compute_module4_connector (Y?.193), DSI_and_CSI_Connector (J?#4.11)
DSI1_D2_P: Compute_module4_connector (Y?.195), DSI_and_CSI_Connector (J?#4.12)
DSI1_D3_N: Compute_module4_connector (Y?.194), DSI_and_CSI_Connector (J?#4.14)
DSI1_D3_P: Compute_module4_connector (Y?.196), DSI_and_CSI_Connector (J?#4.15)
HDMI0_CEC: Compute_module4_connector (Y?.151), HDMI_Schematic (J?#3.13)
HDMI0_CK_N: Compute_module4_connector (Y?.190), HDMI_Schematic (J?#3.12)
HDMI0_CK_P: Compute_module4_connector (Y?.188), HDMI_Schematic (J?#3.10)
HDMI0_D0_N: Compute_module4_connector (Y?.184), HDMI_Schematic (J?#3.9)
HDMI0_D0_P: Compute_module4_connector (Y?.182), HDMI_Schematic (J?#3.7)
HDMI0_D1_N: Compute_module4_connector (Y?.178), HDMI_Schematic (J?#3.6)
HDMI0_D1_P: Compute_module4_connector (Y?.176), HDMI_Schematic (J?#3.4)
HDMI0_D2_N: Compute_module4_connector (Y?.172), HDMI_Schematic (J?#3.3)
HDMI0_D2_P: Compute_module4_connector (Y?.170), HDMI_Schematic (J?#3.1)
HDMI0_HOTPLUG: Compute_module4_connector (Y?.153), HDMI_Schematic (J?#3.19)
HDMI0_SCL: Compute_module4_connector (Y?.200), HDMI_Schematic (J?#3.15)
HDMI0_SDA: Compute_module4_connector (Y?.199), HDMI_Schematic (J?#3.16)
HDMI1_CEC: Compute_module4_connector (Y?.149), HDMI_Schematic (J?#2.13)
HDMI1_CK_N: Compute_module4_connector (Y?.166), HDMI_Schematic (J?#2.12)
HDMI1_CK_P: Compute_module4_connector (Y?.164), HDMI_Schematic (J?#2.10)
HDMI1_D0_N: Compute_module4_connector (Y?.160), HDMI_Schematic (J?#2.9)
HDMI1_D0_P: Compute_module4_connector (Y?.158), HDMI_Schematic (J?#2.7)
HDMI1_D1_N: Compute_module4_connector (Y?.154), HDMI_Schematic (J?#2.6)
HDMI1_D1_P: Compute_module4_connector (Y?.152), HDMI_Schematic (J?#2.4)
HDMI1_D2_N: Compute_module4_connector (Y?.148), HDMI_Schematic (J?#2.3)
HDMI1_D2_P: Compute_module4_connector (Y?.146), HDMI_Schematic (J?#2.1)
HDMI1_HOTPLUG: Compute_module4_connector (Y?.143), HDMI_Schematic (J?#2.19)
HDMI1_SCL: Compute_module4_connector (Y?.147), HDMI_Schematic (J?#2.15)
HDMI1_SDA: Compute_module4_connector (Y?.145), HDMI_Schematic (J?#2.16)
I2C0_SCL: Compute_module4_connector (U?#1.80), DSI_and_CSI_Connector (J?#4.20 J?#5.20)
I2C0_SDA: Compute_module4_connector (U?#1.82), DSI_and_CSI_Connector (J?#4.21 J?#5.21)
Reserved: Compute_module4_connector (U?#1.76), SD_Card_Schematic (J?#1.10)
SD_CLK: Compute_module4_connector (U?#1.57), SD_Card_Schematic (J?#1.5)
SD_CMD: Compute_module4_connector (U?#1.62), SD_Card_Schematic (J?#1.3)
SD_DAT0: Compute_module4_connector (U?#1.63), SD_Card_Schematic (J?#1.7)
SD_DAT1: Compute_module4_connector (U?#1.67), SD_Card_Schematic (J?#1.8)
SD_DAT2: Compute_module4_connector (U?#1.69), SD_Card_Schematic (J?#1.1)
SD_DAT3: Compute_module4_connector (U?#1.61), SD_Card_Schematic (J?#1.2)
SD_PWR_ON: Compute_module4_connector (U?#1.75), SD_Card_Schematic (R?#7.1 U?#2.4)